# Altium schematic sheet ShiftRegisters.SchDoc
size C; SheetNumber: 5; SheetTotal: 5
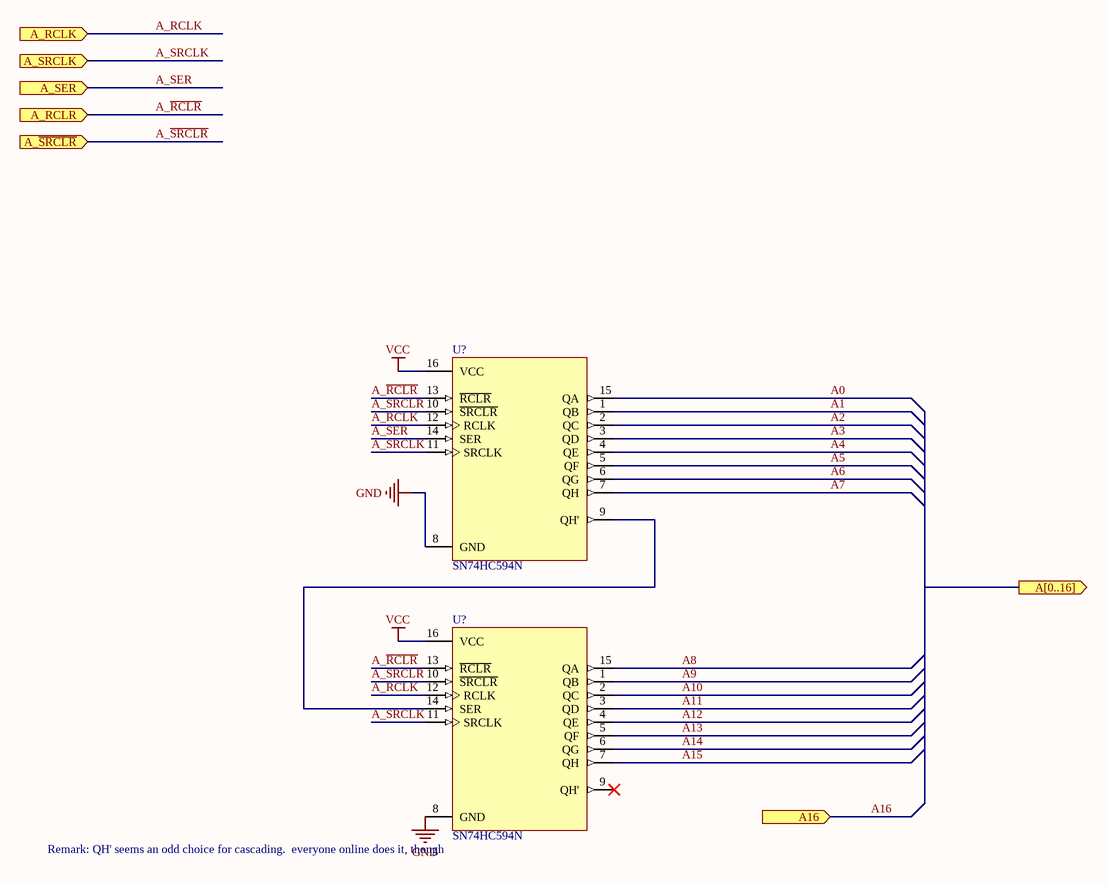
[diagram p0: ShiftRegisters.SchDoc]

## Parts
(Parts that share a designator on the sheet are numbered #1, #2 ... from top to bottom, then left to right.)
U?#1  SN74HC594N  [DIP794W45P254L1969H508Q16]
U?#2  SN74HC594N  [DIP794W45P254L1969H508Q16]

## Ports
A16 (in), A[0..16] (out), A_RCLK (in), A_RCLR (in), A_SER (in), A_SRCLK (in), A_~{SRCLR} (in)

## Nets
GND: U?#1.8(GND) U?#2.8(GND)
VCC: U?#1.16(VCC) U?#2.16(VCC)
A0: U?#1.15(QA)
A1: U?#1.1(QB)
A2: U?#1.2(QC)
A3: U?#1.3(QD)
A4: U?#1.4(QE)
A5: U?#1.5(QF)
A6: U?#1.6(QG)
A7: U?#1.7(QH)
A8: U?#2.15(QA)
A9: U?#2.1(QB)
A10: U?#2.2(QC)
A11: U?#2.3(QD)
A12: U?#2.4(QE)
A13: U?#2.5(QF)
A14: U?#2.6(QG)
A15: U?#2.7(QH)
A16: port A16
A_~{RCLR}: U?#1.13(~{RCLR}) U?#2.13(~{RCLR}) ; port A_RCLR
A_RCLK: U?#1.12(RCLK) U?#2.12(RCLK) ; port A_RCLK
A_~{SRCLR}: U?#1.10(~{SRCLR}) U?#2.10(~{SRCLR}) ; port A_~{SRCLR}
A_SER: U?#1.14(SER) ; port A_SER
A_SRCLK: U?#1.11(SRCLK) U?#2.11(SRCLK) ; port A_SRCLK
NetU?#1_9: U?#1.9(QH') U?#2.14(SER)

Not connected (* = marked no-connect by the designer): U?#2 9(QH')*

## Notes on the sheet
- (near U?#2) Remark: QH' seems an odd choice for cascading.  everyone online does it, though

## Library data of the parts
U?#1 U?#2 = SN74HC594N: 8-Bit Shift Registers With Output Registers 16-PDIP -40 to 125; MF: Texas Instruments; Value: *; Price: None; Package: PDIP-16 Texas Instruments; Availability: Good; Purchase-URL: https://pricing.snapeda.com/search/part/SN74HC594N/?ref=eda; SnapEDA_Link: https://www.snapeda.com/parts/SN74HC594N/Texas%20Instruments/view-part/438437/?ref=snap; Check_prices: https://www.snapeda.com/parts/SN74HC594N/Texas%20Instruments/view-part/438437/?ref=eda; MP: SN74HC594N